# EAGLE design W700A (EAGLE 6.6.0)
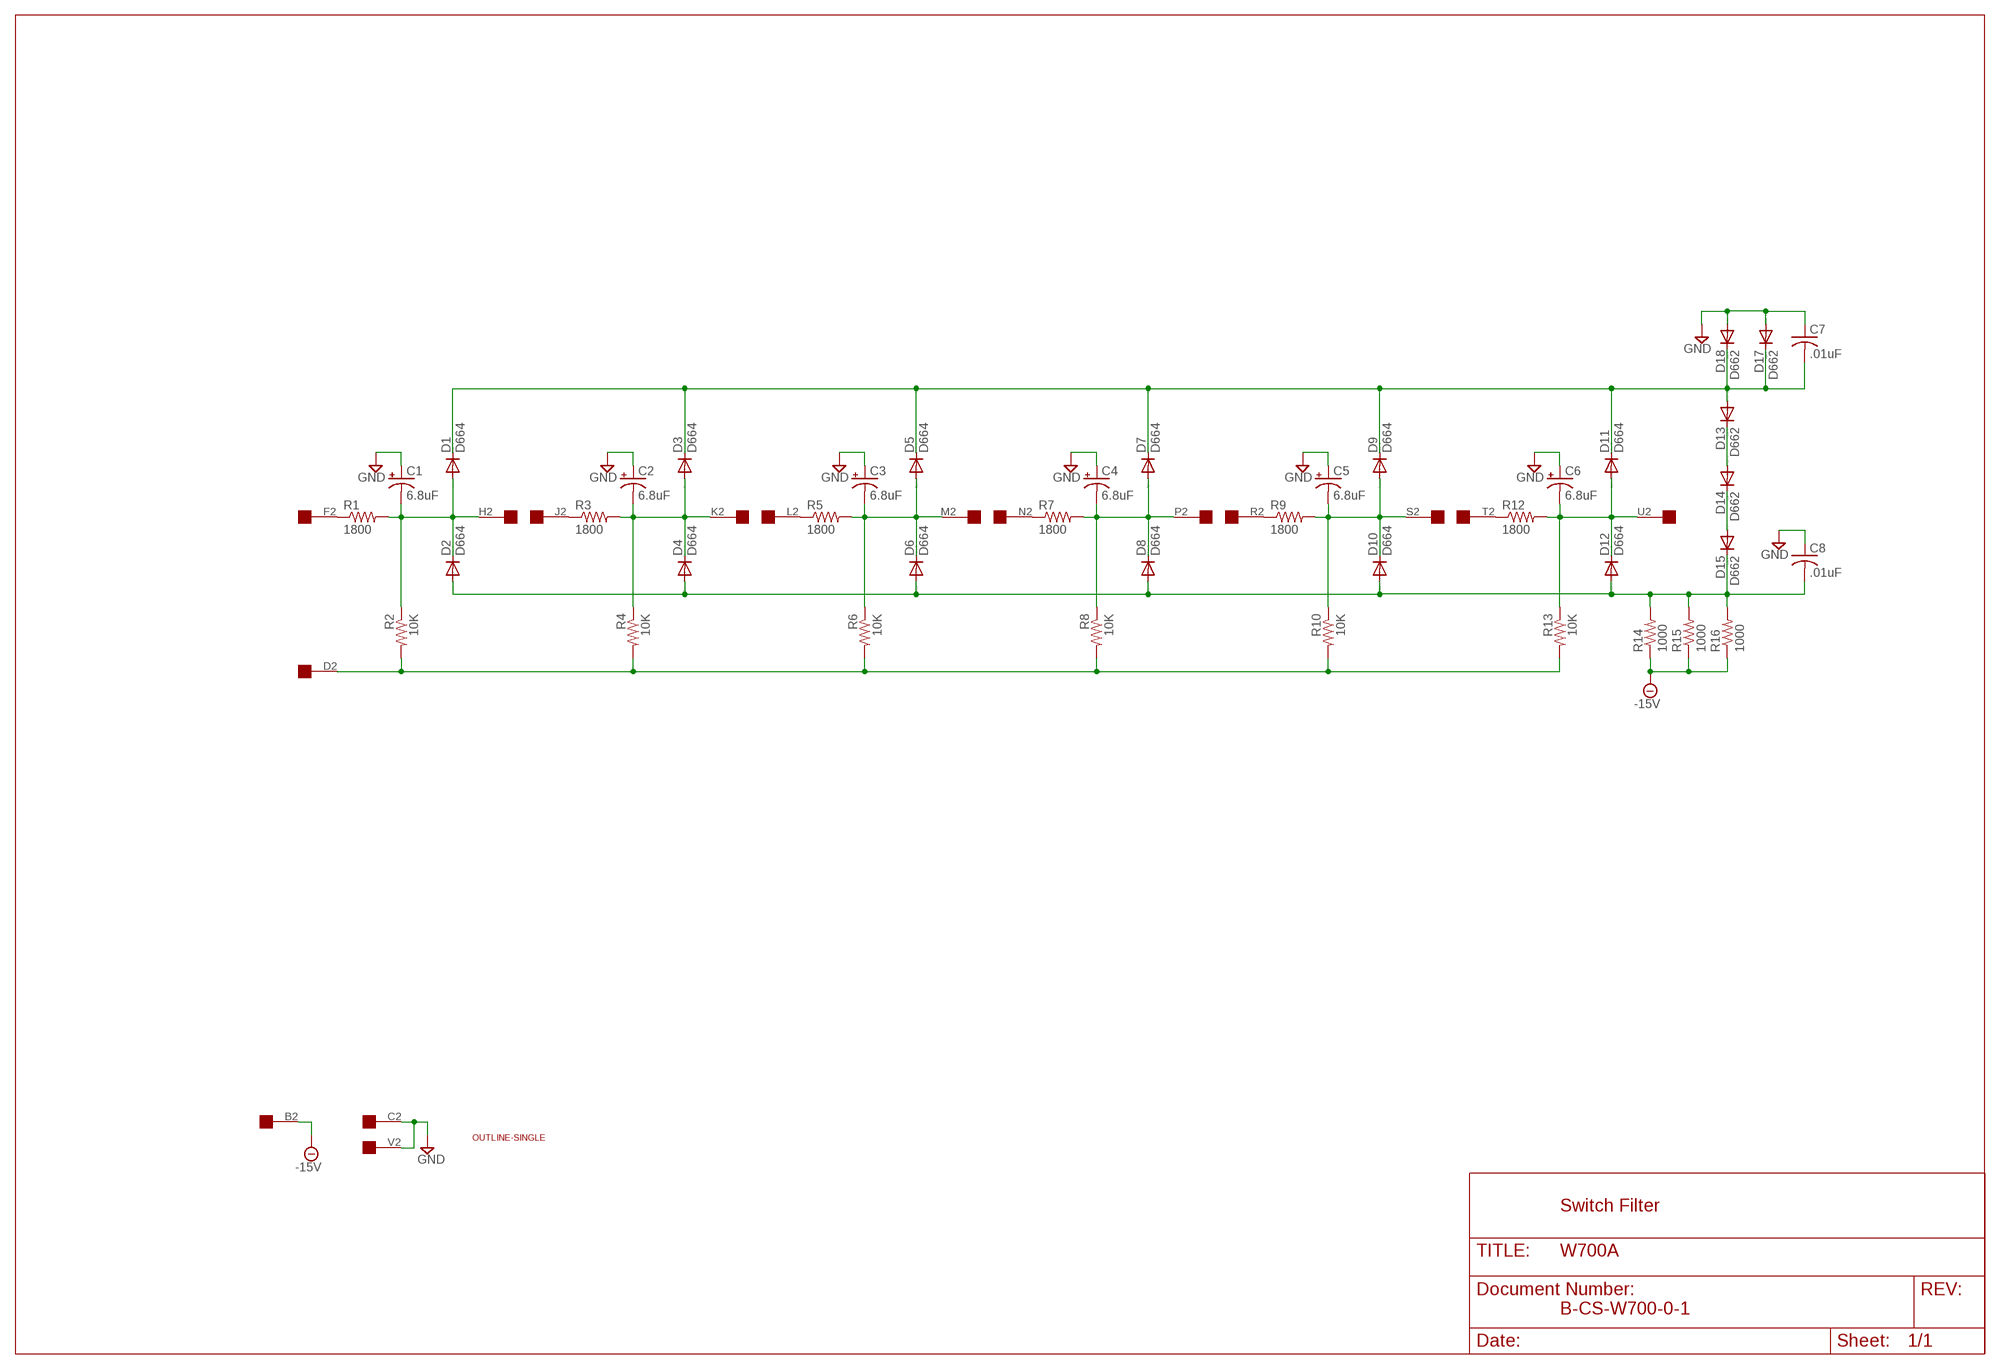
[diagram p0: schematic, sheet 1]

## Parts
C1  6.8uF  CPOL-USE15-5AXIAL  [E15-5]
C2  6.8uF  CPOL-USE15-5AXIAL  [E15-5]
C3  6.8uF  CPOL-USE15-5AXIAL  [E15-5]
C4  6.8uF  CPOL-USE15-5AXIAL  [E15-5]
C5  6.8uF  CPOL-USE15-5AXIAL  [E15-5]
C6  6.8uF  CPOL-USE15-5AXIAL  [E15-5]
C7  .01uF  C-US050-025X075  [C050-025X075]
C8  .01uF  C-US050-025X075  [C050-025X075]
D1  D664  DIODE-DO35-10  [DO35-10]
D2  D664  DIODE-DO35-10  [DO35-10]
D3  D664  DIODE-DO35-10  [DO35-10]
D4  D664  DIODE-DO35-10  [DO35-10]
D5  D664  DIODE-DO35-10  [DO35-10]
D6  D664  DIODE-DO35-10  [DO35-10]
D7  D664  DIODE-DO35-10  [DO35-10]
D8  D664  DIODE-DO35-10  [DO35-10]
D9  D664  DIODE-DO35-10  [DO35-10]
D10  D664  DIODE-DO35-10  [DO35-10]
D11  D664  DIODE-DO35-10  [DO35-10]
D12  D664  DIODE-DO35-10  [DO35-10]
D13  D662  DIODE-DO35-10  [DO35-10]
D14  D662  DIODE-DO35-10  [DO35-10]
D15  D662  DIODE-DO35-10  [DO35-10]
D17  D662  DIODE-DO35-10  [DO35-10]
D18  D662  DIODE-DO35-10  [DO35-10]
R1  1800  R-US_0207/10  [0207/10]
R2  10K  R-US_0207/10  [0207/10]
R3  1800  R-US_0207/10  [0207/10]
R4  10K  R-US_0207/10  [0207/10]
R5  1800  R-US_0207/10  [0207/10]
R6  10K  R-US_0207/10  [0207/10]
R7  1800  R-US_0207/10  [0207/10]
R8  10K  R-US_0207/10  [0207/10]
R9  1800  R-US_0207/10  [0207/10]
R10  10K  R-US_0207/10  [0207/10]
R12  1800  R-US_0207/10  [0207/10]
R13  10K  R-US_0207/10  [0207/10]
R14  1000  R-US_0207/10  [0207/10]
R15  1000  R-US_0207/10  [0207/10]
R16  1000  R-US_0207/10  [0207/10]
U$1  OUTLINE-SINGLE  [SINGLE]
U$3  EDGE-1  [EDGE-CON1]

## Nets
-15V: R14.1 R15.1 R16.1 U$3.B2
D2: R2.2 R4.2 R6.2 R8.2 R10.2 R13.2 U$3.D2
F2: R1.1 U$3.F2
GND: C1.+ C2.+ C3.+ C4.+ C5.+ C6.+ C7.1 C8.1 D17.A D18.A U$3.C2 U$3.V2
H2: C1.- D1.A D2.C R1.2 R2.1 U$3.H2
J2: R3.1 U$3.J2
K2: C2.- D3.A D4.C R3.2 R4.1 U$3.K2
L2: R5.1 U$3.L2
N$1: C8.2 D2.A D4.A D6.A D8.A D10.A D12.A D15.C R14.2 R15.2 R16.2
N$2: R7.1 U$3.N2
N$3: C3.- D5.A D6.C R5.2 R6.1 U$3.M2
N$4: C7.2 D1.C D3.C D5.C D7.C D9.C D11.C D13.A D17.C D18.C
N$5: D14.C D15.A
N$6: D13.C D14.A
P2: C4.- D7.A D8.C R7.2 R8.1 U$3.P2
R2: R9.1 U$3.R2
S2: C5.- D9.A D10.C R9.2 R10.1 U$3.S2
T2: R12.1 U$3.T2
U2: C6.- D11.A D12.C R12.2 R13.1 U$3.U2
Unconnected: U$3.A2 U$3.E2

## Notes on the sheet
- Switch Filter
- B-CS-W700-0-1

## Library data of the parts
C1-C6 = dec-con:CPOL-USE15-5AXIAL: 0.6" version of an electrolytic
C7 C8 = rcl:C-US: CAPACITOR, American symbol
D1-D15 D17 D18 = diode:DIODE-: DIODE
R1-R10 R12-R16 = rcl:R-US_: RESISTOR, American symbol
U$1 = dec-con:OUTLINE-*: Board outlines for DEC boards.
U$3 = dec-con:EDGE-1: Single-Sided DEC Edge Connector -- (side 2)

## Board
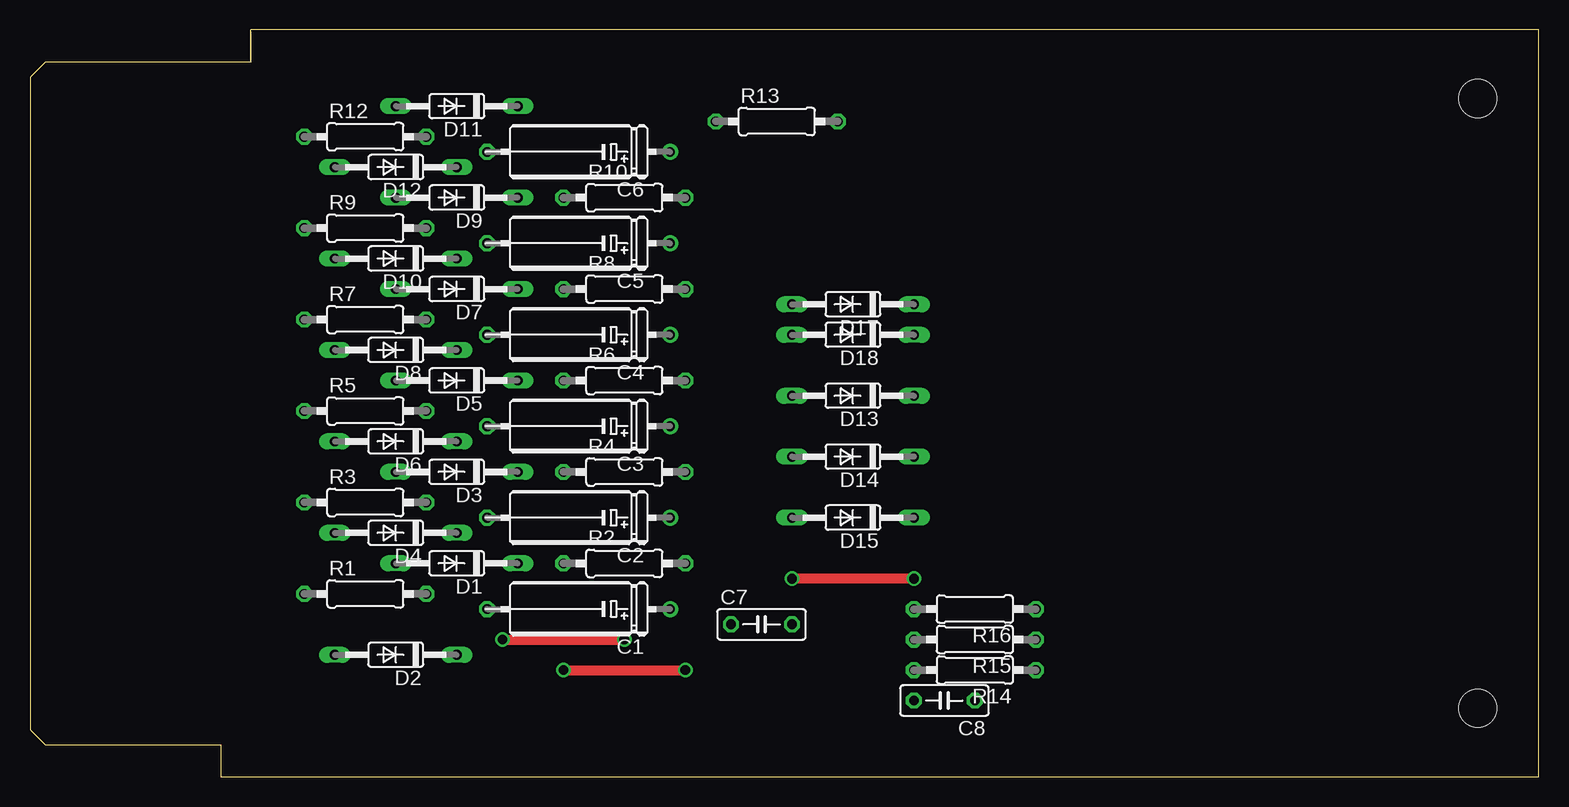
[diagram p1: board, top side]
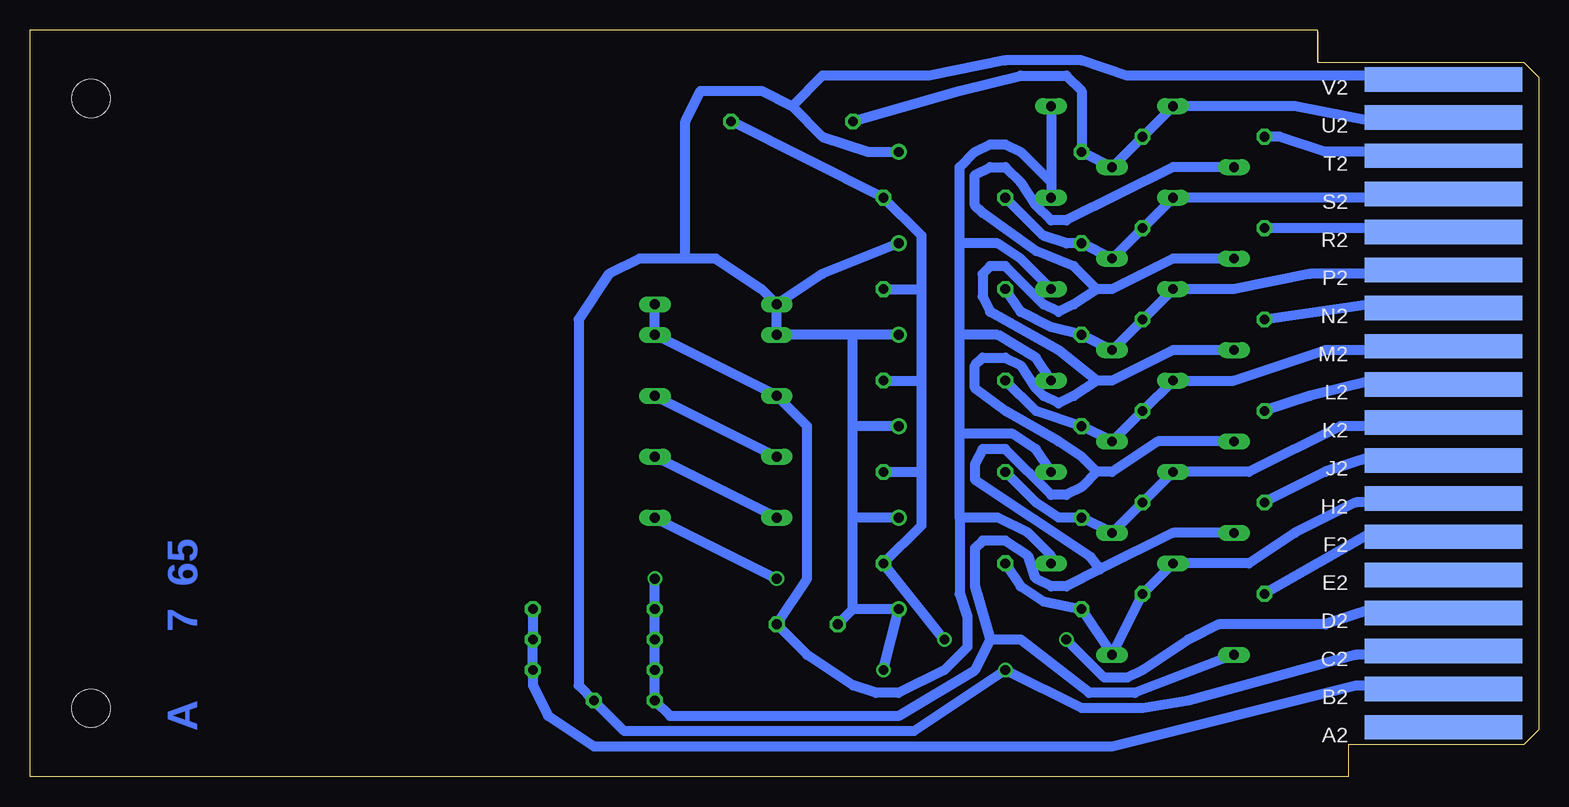
[diagram p2: board, bottom side, seen from below]

Size 125.73 x 62.23 mm. Coordinates in mm from the lower left corner, seen from the top.
Copper layers (1+16): Top 0.035mm / dielectric 1.5mm / Bottom 0.035mm
Design rules "16mils": minimum track width 16mil, minimum drill 32mil, track to track 15mil, track to pad 10mil, pad to pad 10mil, via to via 10mil, smd to smd 10mil, copper to edge 13mil, drill to drill 10mil, minimum pad ring 10mil, minimum via ring 8mil, stop-mask expansion 0mil, vias tented up to drill 0mil, thermal gap 10mil

### Footprints (pad centres in the part's own frame; a part is rotated, then mirrored left to right if it is on the bottom)
E15-5 = drill 0.813: + -7.62,0 | drill 0.813 octagon: - 7.62,0
C050-025X075 = drill 0.813 octagon: 1 -2.54,0; 2 2.54,0
DO35-10 = drill 0.813 long: A 5.08,0; C -5.08,0
0207/10 = drill 0.813 octagon: 1 -5.08,0; 2 5.08,0
SINGLE = hole 3.175: 120.65,56.515; 120.65,5.715
EDGE-CON1 = smd 13.106 x 2.032 bottom: A2 7.938,4.128; B2 7.938,7.303; C2 7.938,10.477; D2 7.938,13.652; E2 7.938,16.828; F2 7.938,20.003; H2 7.938,23.177; J2 7.938,26.352; K2 7.938,29.527; L2 7.938,32.703; M2 7.938,35.877; N2 7.938,39.053; P2 7.938,42.227; R2 7.938,45.403; S2 7.938,48.578; T2 7.938,51.752; U2 7.938,54.928; V2 7.938,58.102

### Placement (x,y rotation side)
C1  45.72,13.97 180 top
C2  45.72,21.59 180 top
C3  45.72,29.21 180 top
C4  45.72,36.83 180 top
C5  45.72,44.45 180 top
C6  45.72,52.07 180 top
C7  60.96,12.7 0 top
C8  76.2,6.35 180 top
D1  35.56,17.78 180 top
D2  30.48,10.16 180 top
D3  35.56,25.4 180 top
D4  30.48,20.32 180 top
D5  35.56,33.02 180 top
D6  30.48,27.94 180 top
D7  35.56,40.64 180 top
D8  30.48,35.56 180 top
D9  35.56,48.26 180 top
D10  30.48,43.18 180 top
D11  35.56,55.88 180 top
D12  30.48,50.8 180 top
D13  68.58,31.75 180 top
D14  68.58,26.67 180 top
D15  68.58,21.59 180 top
D17  68.58,39.37 180 top
D18  68.58,36.83 180 top
R1  27.94,15.24 0 top
R2  49.53,17.78 0 top
R3  27.94,22.86 0 top
R4  49.53,25.4 0 top
R5  27.94,30.48 0 top
R6  49.53,33.02 0 top
R7  27.94,38.1 0 top
R8  49.53,40.64 0 top
R9  27.94,45.72 0 top
R10  49.53,48.26 0 top
R12  27.94,53.34 0 top
R13  62.23,54.61 0 top
R14  78.74,8.89 180 top
R15  78.74,11.43 180 top
R16  78.74,13.97 180 top
U$1  0,0 0 top
U$3  0,0 0 top

### Tracks (layer width: path | path; a pad name or v marks a point on that pad's centre or on a via)
-15V
  Bottom 0.813: R16.1 R15.1 R14.1 83.82,7.62 82.55,5.08 78.74,2.54 35.56,2.54 15.24,7.62 8.89,7.62 U$3.B2
D2  (via drill 0.81)
  Top 0.813: v39.37,11.43 v49.53,11.43
  Bottom 0.813: 51.44,25.4 51.44,20.95 R2.2 v49.53,11.43 | 51.44,25.4 51.44,33.02 | 51.44,33.02 51.44,40.64 | 51.44,40.64 51.44,45.09 R10.2 R13.2 | R8.2 51.44,40.64 | R6.2 51.44,33.02 | R4.2 51.44,25.4 | U$3.D2 8.89,13.97 13.97,13.97 17.78,12.7 26.67,12.7 29.21,11.43 33.02,8.89 34.29,8.26 36.2,8.26 v39.37,11.43
F2
  Bottom 0.813: U$3.F2 7.62,20 7.62,20.32 13.97,20.32 R1.1
GND  (via drill 0.81)
  Top 0.813: v44.45,8.89 v54.61,8.89
  Bottom 0.813: U$3.V2 8.89,58.42 34.29,58.42 38.1,59.69 44.45,59.69 50.8,58.42 59.69,58.42 62.23,55.88 | 62.23,55.88 59.69,53.34 55.88,52.07 C6.+ | D17.A 64.77,40.64 68.58,43.18 71.12,43.18 | 71.12,43.18 71.12,54.61 69.85,57.15 64.77,57.15 62.23,55.88 | D17.A D18.A 57.15,36.83 | C4.+ 57.15,36.83 | 57.15,13.97 C1.+ v54.61,8.89 | C7.1 57.15,13.97 | 57.15,13.97 57.15,21.59 | 57.15,21.59 57.15,29.21 | 57.15,29.21 57.15,36.83 | C3.+ 57.15,29.21 | C2.+ 57.15,21.59 | U$3.C2 8.89,10.16 15.24,10.16 29.21,6.35 33.02,5.71 38.1,5.71 v44.45,8.89 52.07,3.81 76.2,3.81 C8.1 80.01,7.62 80.01,38.1 77.47,41.91 74.93,43.18 71.12,43.18 | C5.+ 59.69,41.91 D17.A
H2
  Bottom 0.813: R2.1 43.18,15.88 41.28,14.61 C1.- D2.C R1.2 D1.A 24.13,17.78 20.32,20.32 15.24,22.86 8.89,22.86 U$3.H2
J2
  Bottom 0.813: U$3.J2 8.89,26.67 13.97,26.67 17.78,25.4 R3.1
K2
  Bottom 0.813: U$3.K2 8.89,29.21 16.51,29.21 24.13,25.4 D3.A R3.2 D4.C C2.- 40.01,21.59 41.91,22.86 R4.1
L2
  Bottom 0.813: U$3.L2 8.89,33.02 13.97,33.02 19.05,31.75 R5.1
N$1  (via drill 0.81)
  Top 0.813: v73.66,16.51 v63.5,16.51
  Bottom 0.813: D15.C v63.5,16.51 | D2.A 33.66,6.99 37.47,6.99 43.18,11.43 45.72,11.43 | 45.72,11.43 46.99,8.89 53.34,5.08 72.39,5.08 C8.2 R14.2 R15.2 R16.2 v73.66,16.51 | D4.A 30.48,20.32 36.58,17.27 | 36.58,17.27 39.37,15.88 40.64,15.88 41.91,16.51 42.55,18.41 44.45,19.68 46.36,19.68 46.99,19.05 46.99,15.88 45.72,11.43 | D6.A 31.75,27.94 35.56,25.4 36.83,25.4 | 36.83,25.4 38.1,24.13 39.37,23.5 40.64,23.5 44.45,27.3 46.36,27.3 46.99,26.04 46.99,24.77 37.47,18.41 36.58,17.27 | D12.A 30.48,50.8 39.37,46.35 40.64,46.35 41.91,47.62 43.18,49.53 44.45,50.8 45.72,50.8 46.99,50.16 46.99,47.62 46.36,46.99 41.91,43.81 38.74,42.55 36.83,40.64 | D10.A 30.48,43.18 35.56,40.64 36.83,40.64 | D8.A 30.48,35.56 35.56,33.02 36.83,33.02 | 36.83,25.4 38.1,26.67 40.01,27.94 44.45,30.48 46.99,32.38 46.99,34.29 46.36,34.92 44.45,34.92 43.18,34.29 41.91,32.38 41.28,31.75 40.01,31.11 38.74,31.75 36.83,33.02 | 36.83,40.64 38.74,39.37 40.01,38.73 41.28,39.37 44.45,42.55 45.72,42.55 46.36,41.91 46.36,40.01 45.72,38.73 40.01,35.56 36.83,33.02
N$2
  Bottom 0.813: U$3.N2 8.89,39.37 13.97,39.37 R7.1
N$3
  Bottom 0.813: R6.1 41.91,30.48 C3.- D6.C R5.2 D5.A 25.4,33.02 17.78,35.56 8.89,35.56 U$3.M2
N$4
  Bottom 0.813: D17.C D18.C D13.A 60.96,29.21 60.96,16.51 C7.2 60.96,10.16 57.15,7.62 55.25,6.99 53.34,6.99 49.53,8.89 47.63,10.79 47.63,13.34 48.26,15.24 48.26,21.59 | D11.C 40.64,49.53 | 40.64,49.53 D9.C | D1.C 40.64,18.41 42.55,20.32 45.09,21.59 48.26,21.59 | 48.26,21.59 48.26,28.57 | 48.26,28.57 48.26,36.83 | 48.26,36.83 48.26,44.45 | 48.26,44.45 48.26,50.8 46.99,52.07 45.72,52.7 44.45,52.7 43.18,52.07 40.64,49.53 | D7.C 43.18,43.18 45.09,44.45 48.26,44.45 | D5.C 41.91,34.92 45.09,36.83 48.26,36.83 | D3.C 41.91,27.3 43.82,28.57 48.26,28.57
N$5
  Bottom 0.813: D15.A D14.C
N$6
  Bottom 0.813: D13.C D14.A
P2
  Bottom 0.813: U$3.P2 8.89,41.91 19.05,41.91 25.4,40.64 D7.A R7.2 D8.C C4.- 40.64,37.47 43.18,38.73 R8.1
R2
  Bottom 0.813: U$3.R2 8.89,45.72 R9.1
S2
  Bottom 0.813: R10.1 41.28,45.09 39.37,44.45 C5.- D10.C R9.2 D9.A 8.89,48.26 U$3.S2
T2
  Bottom 0.813: U$3.T2 8.89,52.07 17.78,52.07 21.59,53.34 R12.1
U2
  Bottom 0.813: U$3.U2 8.89,54.61 13.97,54.61 20.32,55.88 D11.A R12.2 D12.C C6.- 38.1,57.15 39.37,58.42 43.18,58.42 48.26,57.15 R13.1

### Text on the board
Bottom: 65 | 7 | A